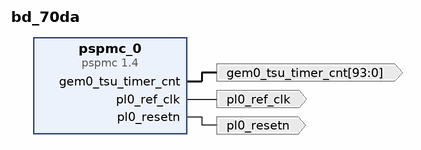
[diagram p0: block diagram of the top level]
# Vivado block design bd_70da, xcvc1902-vsva2197-2MP-e-S, Vivado 2023.2
create_bd_design bd_70da

create_bd_port -dir O -type clk pl0_ref_clk
set_property -dict {CONFIG.FREQ_HZ 333333008} [get_bd_ports pl0_ref_clk]
create_bd_port -dir O -type rst pl0_resetn
create_bd_port -dir O -from 93 -to 0 gem0_tsu_timer_cnt

create_bd_cell -type ip -vlnv xilinx.com:ip:pspmc:1.4 pspmc_0
